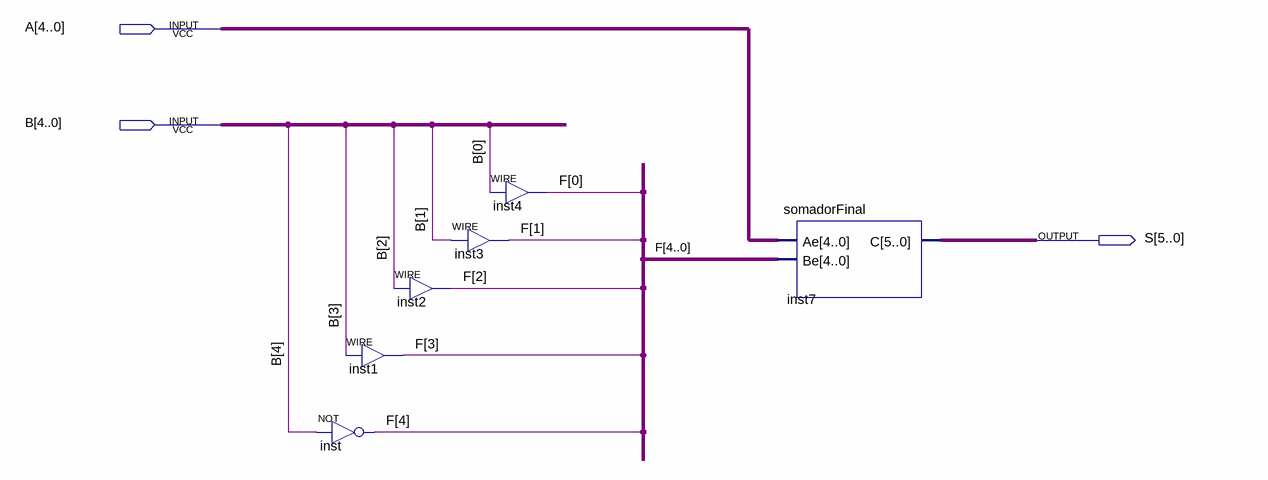
[diagram p0: schematic sheet]
// Quartus schematic subtrator.bdf as structural Verilog: 6 symbols, 3 pins
module subtrator (
  input  [4:0] A,
  input  [4:0] B,
  output [5:0] S
);

  wire [4:0] F;

  not inst (F[4], B[4]);
  assign F[2] = B[2];  // WIRE inst2
  assign F[3] = B[3];  // WIRE inst1
  assign F[1] = B[1];  // WIRE inst3
  assign F[0] = B[0];  // WIRE inst4
  somadorFinal inst7 (.Ae(A), .Be(F), .C(S));
endmodule
